# Altium project PROJEKT_PCB_299423.PrjPcb
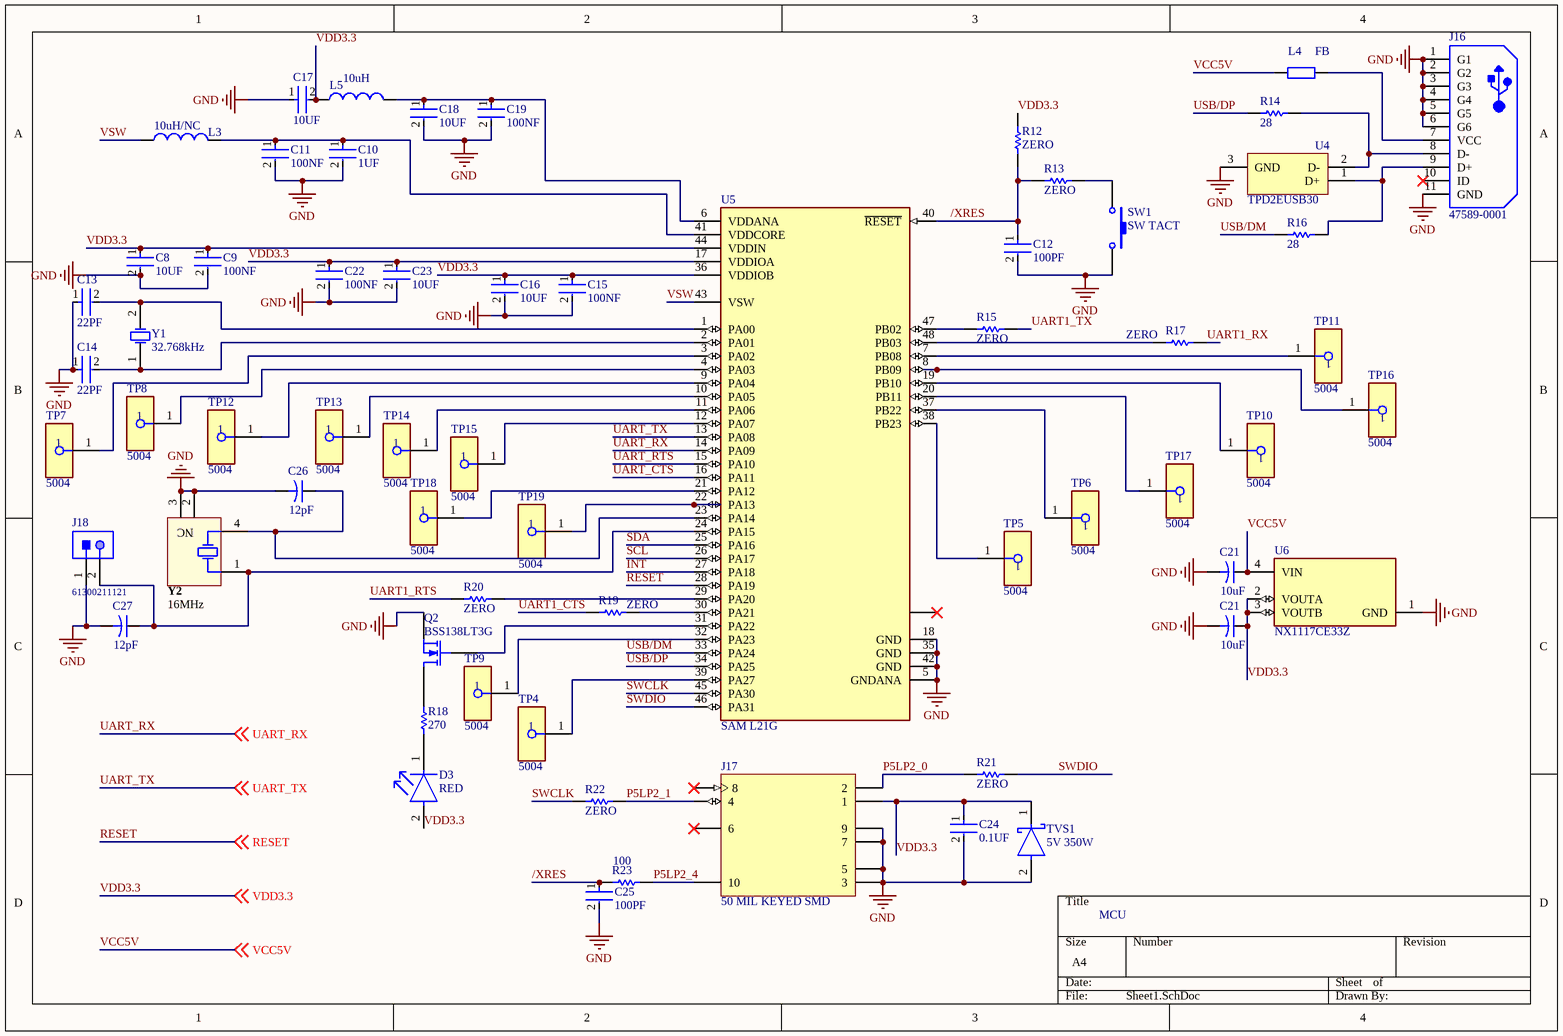
[diagram p0: Sheet1.SchDoc]
3 sheets, 112 parts. Net scope: global (net labels, ports and power ports of the same name join across sheets).
Board file: PCB2.PcbDoc
Sheets:
  Sheet1.SchDoc
  Sheet2.SchDoc
  Sheet3.SchDoc

## Sheet Sheet1.SchDoc
size A4; SheetNumber: 1; SheetTotal: 3

### Parts
(Parts that share a designator on the sheet are numbered #1, #2 ... from top to bottom, then left to right.)
10uH/NC  L3  [0402-A]
C8  10UF  [FP-C0805C-DN-MFG]
C9  100NF  [FP-C0805C-DN-MFG]
C10  1UF  [FP-C0805C-DN-MFG]
C11  100NF  [FP-C0805C-DN-MFG]
C12  100PF  [FP-C0805C-DN-MFG]
C13  22PF  [FP-C0805C-DN-MFG]
C14  22PF  [FP-C0805C-DN-MFG]
C15  100NF  [FP-C0805C-DN-MFG]
C16  10UF  [FP-C0805C-DN-MFG]
C17  10UF  [FP-C0805C-DN-MFG]
C18  10UF  [FP-C0805C-DN-MFG]
C19  100NF  [FP-C0805C-DN-MFG]
C21#1  value 10uF  [CAPR5-4X5]  (hidden comment: Cap2)
C21#2  value 10uF  [CAPR5-4X5]  (hidden comment: Cap2)
C22  100NF  [FP-C0805C-DN-MFG]
C23  10UF  [FP-C0805C-DN-MFG]
C24  0.1UF  [FP-C0805C-DN-MFG]
C25  100PF  [FP-C0805C-DN-MFG]
C26  value 12pF  [CAPR5-4X5]  (hidden comment: Cap2)
C27  value 12pF  [CAPR5-4X5]  (hidden comment: Cap2)
D3  RED  [FP-LTST-C190GKT-MFG]
FB  value L4  [AXIAL-0.4]  (hidden comment: Res2)
J16  47589-0001  [MOLX-47589-0001_V]
J17  50 MIL KEYED SMD  [VISH-VCNL4020-GS08_V]
J18  61300211121  [61300211121]
L5  value 10uH  [0402-A]  (hidden comment: Inductor)
Q2  BSS138LT3G  [E3]
R12  ZERO  [RESC1005X40X25NL05T10]
R13  ZERO  [RESC1005X40X25NL05T10]
R14  28  [RESC1005X40X25NL05T10]
R15  ZERO  [RESC1005X40X25NL05T10]
R16  28  [RESC1005X40X25NL05T10]
R17  ZERO  [RESC1005X40X25NL05T10]
R18  270  [RESC1005X40X25NL05T10]
R19  ZERO  [RESC1005X40X25NL05T10]
R20  ZERO  [RESC1005X40X25NL05T10]
R21  ZERO  [RESC1005X40X25NL05T10]
R22  ZERO  [RESC1005X40X25NL05T10]
R23  100  [RESC1005X40X25NL05T10]
SW1  SW TACT  [SPST-2]
TP4  5004  [FP-5004-MFG]
TP5  5004  [FP-5004-MFG]
TP6  5004  [FP-5004-MFG]
TP7  5004  [FP-5004-MFG]
TP8  5004  [FP-5004-MFG]
TP9  5004  [FP-5004-MFG]
TP10  5004  [FP-5004-MFG]
TP11  5004  [FP-5004-MFG]
TP12  5004  [FP-5004-MFG]
TP13  5004  [FP-5004-MFG]
TP14  5004  [FP-5004-MFG]
TP15  5004  [FP-5004-MFG]
TP16  5004  [FP-5004-MFG]
TP17  5004  [FP-5004-MFG]
TP18  5004  [FP-5004-MFG]
TP19  5004  [FP-5004-MFG]
TVS1  5V 350W  [FP-PowerDI123-MFG]
U4  TPD2EUSB30  [DRT0003A]
U5  SAM L21G  [FP-PE-MFG]
U6  NX1117CE33Z  [FP-DZD0004A-MFG]
Y1  32.768kHz  [R38]
Y2  16MHz  [ABRA-ABS25-4_V]

### Nets
GND: C8.2 C9.2 C10.2 C11.2 C12.2 C13.1 C14.1 C15.2 C16.2 C17.1 C18.2 C19.2 C21#1.2 C21#2.2 C22.2 C23.2 C24.2 C25.2 C26.2 C27.2 J16.1(G1) J16.2(G2) J16.3(G3) J16.4(G4) J16.5(G5) J16.6(G6) J16.11(GND) J17.6(9) J17.7 J17.8(5) J17.9(3) J18.1 Q2.3(S) SW1.2 TVS1.2(A) U4.3(GND) U5.5(GNDANA) U5.18(GND) U5.35(GND) U5.42(GND) U6.1(GND) Y2.2 Y2.3
/XRES: C12.1 C25.1 R12.1 R13.1 R23.1 U5.40(~{RESET})
INT: U5.27(PA18)
P5LP2_0: J17.1(2) R21.1
P5LP2_1: J17.2(4) R22.2
P5LP2_4: J17.5(10) R23.2
RESET: U5.28(PA19) ; off-sheet RESET
SCL: U5.26(PA17)
SDA: U5.25(PA16)
SWCLK: R22.1 U5.45(PA30)
SWDIO: R21.2 U5.46(PA31)
UART1_CTS: R19.1
UART1_RTS: R20.1
UART1_RX: R17.2
UART1_TX: R15.2
UART_CTS: U5.16(PA11)
UART_RTS: U5.15(PA10)
UART_RX: U5.14(PA09) ; off-sheet UART_RX
UART_TX: U5.13(PA08) ; off-sheet UART_TX
USB/DM: R16.1 U5.33(PA24)
USB/DP: R14.1 U5.34(PA25)
VCC5V: C21#1.1 FB.1 U6.4(VIN) ; off-sheet VCC5V
VDD3.3: C8.1 C9.1 C15.1 C16.1 C17.2 C21#2.1 C22.1 C23.1 C24.1 D3.2(A) J17.10(1) L5.1 R12.2 TVS1.1(C) U5.17(VDDIOA) U5.36(VDDIOB) U5.44(VDDIN) U6.2(VOUTA) U6.3(VOUTB) ; off-sheet VDD3.3
VSW: 10uH/NC.1 U5.43(VSW)
Net10uH/NC_2: 10uH/NC.2 C10.1 C11.1 U5.41(VDDCORE)
NetC13_2: C13.2 U5.1(PA00) Y1.2(OSC2)
NetC14_2: C14.2 U5.2(PA01) Y1.1(OSC1)
NetC18_1: C18.1 C19.1 L5.2 U5.6(VDDANA)
NetC26_1: C26.1 U5.23(PA14) Y2.4(X2)
NetC27_1: C27.1 J18.2 U5.24(PA15) Y2.1(X1)
NetD3_1: D3.1(C) R18.1
NetFB_2: FB.2 J16.7(VCC)
NetJ16_8: J16.8(D-) R14.2 U4.2(D-)
NetJ16_9: J16.9(D+) R16.2 U4.1(D+)
NetQ2_1: Q2.1(D) R18.2
NetQ2_2: Q2.2(G) U5.31(PA22)
NetR13_2: R13.2 SW1.1
NetR15_1: R15.1 U5.47(PB02)
NetR17_1: R17.1 U5.48(PB03)
NetR19_2: R19.2 U5.30(PA21)
NetR20_2: R20.2 U5.29(PA20)
NetTP4_1: TP4.1 U5.39(PA27)
NetTP5_1: TP5.1 U5.38(PB23)
NetTP6_1: TP6.1 U5.37(PB22)
NetTP7_1: TP7.1 U5.3(PA02)
NetTP8_1: TP8.1 U5.4(PA03)
NetTP9_1: TP9.1 U5.32(PA23)
NetTP10_1: TP10.1 U5.19(PB10)
NetTP11_1: TP11.1 U5.7(PB08)
NetTP12_1: TP12.1 U5.9(PA04)
NetTP13_1: TP13.1 U5.10(PA05)
NetTP14_1: TP14.1 U5.11(PA06)
NetTP15_1: TP15.1 U5.12(PA07)
NetTP16_1: TP16.1 U5.8(PB09)
NetTP17_1: TP17.1 U5.20(PB11)
NetTP18_1: TP18.1 U5.21(PA12)
NetTP19_1: TP19.1 U5.22(PA13)

Not connected (* = marked no-connect by the designer): J16 10(ID)*; J17 3(6)* 4(8)*; U5 49(EP)*

### Notes on the sheet
- MCU
- (in symbol CMP-2000-05037-1) NC

### Library data of the parts
10uH/NC = Inductor: Code_IEC: 1005; Value: 10uH; Published: 8-Jun-2000; LatestRevisionDate: 29-May-2009; LatestRevisionNote: IPC-7351 Footprint Added.; PackageReference: 0402-A; Publisher: Altium Limited; PackageDescription: Chip Inductor; Code_JEITA: 0402
C8-C19 C22-C25 = CMP-2007-00279-2: CAP CER 0.1UF 50V X7R 0805; Manufacturer Part Number: C0805C104K5RACTU; Manufacturer: KEMET; Value: 0.10 μF; Tolerance: 0.1; Temperature Coefficient: 30ppm/°C; Material: Ceramic; Device Class L2: Capacitors; Temperature Range Low: -55°C; Voltage Rating: 50 V; Digikey Description: CAP CER 0.1UF 50V X7R 0805; Category: Cap; ComponentLink2Description: Datasheet; Octopart: https://octopart.com/c0805c104k5ractu-kemet-143926; RoHS: TRUE; ComponentLink2URL: https://content.kemet.com/datasheets/KEM_C1003_C0G_SMD.pdf; Temperature Characteristic: X7R; Temperature: -55°C to +125°C; Height: 0.88mm; Temperature Range High: +125°C; Device Class L1: Passive Components; Automotive: No; Lead Free: Yes; Ipc Land Pattern Name: CAPC200125X78; Device Class L3: Ceramic Capacitors; Mouser Description: Cap Ceramic 0.1uF 50V X7R 10% SMD 2.0 x 1.2 mm 125 C Paper T/R; Capacitance: 0.10 μF; Package: C0805C-DN
C21#1 C21#2 C26 C27 = Cap2: Capacitor; Published: 23-Sep-2002; PackageReference: CAPR5-4X5; Publisher: Altium Limited; PackageDescription: Capacitor; 2 Leads
D3 = CMP-22017-000005-2: LED GREEN CLEAR CHIP SMD; Dominant Wavelength: 569nm; Reverse Voltage: 5V; Lens Color: Colorless; Viewing Angle: 130°; Voltage: 2V; Forward Current: 30mA; Power Dissipation: 100mW; Luminous Intensity: 6mcd; Number of LEDs: 1; Forward Voltage: 2.1V; Wavelength: 565nm; Test Current: 10mA; Min Operating Temperature: -55°C; Lens Style: Clear; Mount: Surface Mount; Width: 0.8mm; Packaging: Tape and Reel; Lens Transparency: Clear; Case Code (Metric): 1608; Depth: 0.8mm; Case Code (Imperial): 0603; Case/Package: 0603; Number of Pins: 2; Max Operating Temperature: 85°C; Lead Free: Lead Free; Number of Elements: 1; Length: 1.6mm; Height: 0.8mm; Package Quantity: 1; Power Rating: 100mW; Radiation Hardening: No; Illumination Color: Green; Color: Green
FB = Res2: Resistor; Published: 8-Jun-2000; LatestRevisionDate: 17-Jul-2002; LatestRevisionNote: Re-released for DXP Platform.; PackageReference: AXIAL-0.4; Publisher: Altium Limited; PackageDescription: Axial Device, Thru-Hole; 2 Leads; 0.4 in Pin Spacing
J16 = CMP-2000-05610-1: Right Angle Female Type AB Micro USB Connector, 30 V, 1.8 A, -30 to 85 degC, RoHS, Tape and Reel; Number of Ports: 1Port; Current Rating: 1.8A; Brand: Molex; Connector Type: MicroUSBTypeABreceptacle; Number of Contacts: 5Contact; Voltage Rating: 30VAC; Color: Black; Product: MicroUSBTypeABConnectors; Package URL: http://www.molex.com/pdm_docs/sd/475890001_sd.pdf; Contact Plating: Gold; Datasheet URL: http://www.molex.com/webdocs/datasheets/pdf/en-us/0475890001_IO_CONNECTORS.pdf; Operating Temperature Range: -20Cto+85C; Termination Style: SMD/SMT; Mounting Angle: Right; Package Reference: 47589-0001; Gender: Female; Package Description: Micro USB Connector, Pitch 0.65 mm, 5 Positions, Body 7.5 x 5.6 mm; Mounting Technology: SurfaceMount; Contact Material: CopperAlloy; Packaging: Reel; RoHS: True; Standard: USB; Manufacturer URL: http://www.molex.com/; Manufacturer: Molex; Datasheet Version: 12/2016; Product Category: USBConnectors; Series: 47589
J17 = CMP-2000-07387-1: Fully Integrated Proximity and Ambient Light Sensor with Infrared Emitter, I2C Interface, and Interrupt Function, 2.5 to 3.6 V, -25 to 85 degC, 10-Pin SMD, RoHS, Tape and Reel; Manufacturer: Vishay; Output Type: I²C; Other Names: VCNL4020-GS08DKR; Featured Product: VCNL4020OpticalSensor; Voltage - Supply: 2.5V~3.6V; Proximity Detection: Yes; Datasheet URL: http://www.vishay.com/docs/83476/vcnl4020.pdf; Supplier Device Package: SMD; Manufacturer URL: http://www.vishay.com/; Mounting Type: SurfaceMount; Type: Ambient; Package / Case: 10-VDFN; Series: -; Package Reference: VCNL4020-GS08; Wavelength: -; Standard Package: 1; Datasheet Version: Rev. 1.5, 08/2014; Packaging: Digi-Reel®; Package Description: 10-Pin Surface Mount Device, Body 4.9 x 2.4 mm; Family: OpticalSensors-AmbientLight,IR,UVSensors; Operating Temperature: -25°C~85°C; Category: Sensors,Transducers; Mounting Technology: SurfaceMount
J18 = CMP-1712-00002-4: THT Vertical Pin Header WR-PHD, Pitch 2.54 mm, Single Row, 2 pins; Manufacturer: Wurth Elektronik; Rated Current: 3A; Gender: Male; Withstanding Voltage: 500VAC; Working Voltage: 250VAC; Pitch: 2.54mm; Contact Resistance: 20mOhm; Pin Number: 2; Mounting Technology: THT; Orientation: Vertical; Operating Temperature: -40to105degC; Packaging: Bag; Publisher: WurthElektronik; Datasheet URL: https://katalog.we-online.de/em/datasheet/6130xx11121.pdf; Manufacturer URL: http://www.we-online.de; Row Number: Single; Package Reference: 61300211121; Part Number: 61300211121
L5 = Inductor: Code_IEC: 1005; Published: 8-Jun-2000; LatestRevisionDate: 29-May-2009; LatestRevisionNote: IPC-7351 Footprint Added.; PackageReference: 0402-A; Publisher: Altium Limited; PackageDescription: Chip Inductor; Code_JEITA: 0402
Q2 = MOSFET-N: N-Channel MOSFET; Published: 8-Jun-2000; LatestRevisionDate: 17-Jul-2002; LatestRevisionNote: Re-released for DXP Platform.; PackageVersion: 1995/1996; PackageReference: E3; Publisher: Altium Limited; PackageDescription: TO, Flat Index; 3 In-Line, Axial Leads; Body Dia. 4.6mm; Lead Dia. 0.5 mm (max)
R12-R23 = CMP-1011-00001-2: Manufacturer: Yageo / Phycomp; Part Number: RC0402JR-070RL
SW1 = SW-PB: Switch; Published: 24-Mar-1999; LatestRevisionDate: 17-Jul-2002; LatestRevisionNote: Re-released for DXP Platform.; PackageReference: SPST-2; Publisher: Altium Limited; PackageDescription: Switch; 2 Leads
TP4-TP19 = CMP-2000-05575-2: PC TEST POINT MINIATURE YELLOW; Manufacturer: Keystone; Number Of Contacts: 1; Is Female: yes; Device Class L1: Connectors; Manufacturer Part Number: 5004; Digikey Description: PC TEST POINT MINIATURE YELLOW; ComponentLink2URL: https://www.keyelco.com/product-pdf.cfm?p=1313; Lead Free: Yes; ComponentLink2Description: Datasheet; Category: Conn; Height: 4.72mm; Octopart: https://octopart.com/5004-keystone-28591; Mouser Description: TEST POINT PC MINI .040"D YELLOW; Device Class L3: unset; Contact Material: Silver; Package: 5004; Automotive: No; Device Class L2: unset; RoHS: TRUE
TVS1 = CMP-2000-07540-2: DIODE SCHOTTKY 200V POWERDI123; Manufacturer: Diodes Inc.; Manufacturer Part Number: DFLS1200-7; Automotive Grade: Grade 0; Peak Reverse Current: 2uA; Capacitance: 23pF; Forward Current: 1A; Value: 23pF; Max Surge Forward Current: 40A; Max Junction Temp: +175°C; Temperature Range Low: -65°C; Mouser Description: Schottky Diodes & Rectifiers SCHOTTKY RECTIFIER; Package: PowerDI123; Footprint Url: https://www.diodes.com/assets/Package-Files/PowerDI123.pdf; Max Repetitive Reverse Voltage: 200V; Device Class L2: Diodes; Temperature Range High: +175°C; Device Class L1: Discrete Semiconductors; ComponentLink2URL: https://www.diodes.com/assets/Datasheets/ds30628.pdf; Category: Diode; Lead Free: Yes; Temperature: -65°C to +175°C; Reverse Voltage: 200V; Height: 1mm; Digikey Description: DIODE SCHOTTKY 200V POWERDI123; RoHS: TRUE; ComponentLink2Description: Datasheet; Device Class L3: Schottky Diodes; Automotive: Yes; Octopart: https://octopart.com/dfls1200-7-diodes+inc.-13134059
U4 = CMP-0326-00046-3: ESD Solution for Super-Speed (6 Gbps) USB 3.0 Interface, 2 Channels, -40 to +85 degC, 3-pin SOT (DRT), Green (Rohs & No Sb/Br); Manufacturer: Texas Instruments; PartNumber: TPD2EUSB30DRTR; Differential Capacitance(pF): 0.01; Breakdown Voltage(Min)(V): 9; HDMI: TRUE; IEC 61000-4-2 Air-Gap(+/- kV): 8; IO Leakage Current(nA): 10; IO Capacitance(Typ)(pF): 0.7; Mounting Technology: Surface Mount; PackageDescription: 3-Flat Lead Plastic Small Outline, 1 x 1 mm (inc leads), 0.35 mm Pitch; IEC 61000-4-2 Contact(+/- kV): 8; USB Super Speed: TRUE; Eco-Plan: Green (RoHS & no Sb/Br); USB High Speed: TRUE; PackageReference: DRT0003A; SubFamily: ESD Solution; USB Full Speed: TRUE; ComponentLink1Description: Datasheet; ComponentLink2URL: SamplesURL:http://www.ti.com/product/tpd2eusb30#samples; PackageVersion: revD, Jun-2008; ComponentLink2Description: URL Link1; 1394 / Firewire: TRUE; ComponentLink1URL: http://www.ti.com/general/docs/lit/getliterature.tsp?genericPartNumber=TPD2EUSB30&fileType=pdf; DatasheetVersion: SLVSAC2C; Serial ATA / eSATA: TRUE
U5 = CMP-06276-000162-1: IC MCU 32BIT 256KB FLASH 48QFN; Core Architecture: ARM; Peripherals: POR; Oscillator Type: Internal; Frequency: 48MHz; Interface: I2C; Number of I/Os: 37; Case/Package: QFN; Memory Type: FLASH; RoHS Compliant: Yes; Packaging: Tape and Reel; Min Operating Temperature: -40°C; Max Operating Temperature: 85°C; Memory Size: 256KB
U6 = CMP-2000-04961-2: TVS DIODE 5.5V 4SOP; Test Current: 10mA; Clamping Voltage: 105.5V; Direction: Unidirectional; Number of Bidirectional Channels: 2; Min Breakdown Voltage: 11V; Interface: LVDS; Leakage Current: 1nA; Min Supply Voltage: 900mV; ESD Protection: Yes; Capacitance: 1.5pF; Element Configuration: Dual; Mount: Surface Mount; Max Supply Voltage: 5.5V; Number of Channels: 2; Package Quantity: 1; Radiation Hardening: No; Width: 1.4mm; Max Operating Temperature: 85°C; RoHS Compliant: Yes; Power Line Protection: Yes; Depth: 1.4mm; Length: 3.04mm; Height: 1.07mm; Min Operating Temperature: -40°C; Breakdown Voltage: 11V; Lead Free: Lead Free; Number of Pins: 4; Case/Package: SOP; Termination: Solder; Packaging: Tape and Reel; Reverse Standoff Voltage: 5.5V; Max Reverse Leakage Current: 1nA; REACH SVHC: No SVHC
Y1 = XTAL: Crystal Oscillator; Published: 8-Jun-2000; LatestRevisionDate: 17-Jul-2002; LatestRevisionNote: Re-released for DXP Platform.; PackageReference: R38; Publisher: Altium Limited; PackageDescription: Crystal, Thru-Hole; 2 Leads; Body 3.1 x 8.2 mm (Dia.xH)
Y2 = CMP-2000-05037-1: Low Frequency Crystal, 32.768 KHz, -40 to 85 degC, 4-Pin SMD, RoHS, Tape and Reel; Load Capacitance: 12.5pF; Tolerance: 20PPM; Brand: ABRACON; ESR: 50kOhms; Case Length: 8mm; Case Width: 3.8mm; Case Height: 2.5mm; RoHS: Details; Product Category: Crystals; Frequency: 32.768kHz; Datasheet Version: May-11; Series: ABS25; Datasheet URL: https://datasheet.ciiva.com/7998/1700987-7998663.pdf; Termination Style: SMD/SMT; Package Reference: ABS25; Dimensions: 3.8mmWx8mmLx2.5mmH; Package / Case: 8mmx3.8mm; Manufacturer: Abracon; Manufacturer URL: http://www.abracon.com/; Mounting Style: SMD/SMT; Package Description: 4-Pin Surface Mount Device, Body 8 x 3.8 mm, Pitch 5.5 mm; Operating Temperature Range: -40Cto+85C; Factory Pack Quantity: 1000; Type: LowFrequencyCrystal; Packaging: Reel

## Sheet Sheet2.SchDoc
size A4; SheetNumber: 2; SheetTotal: 3
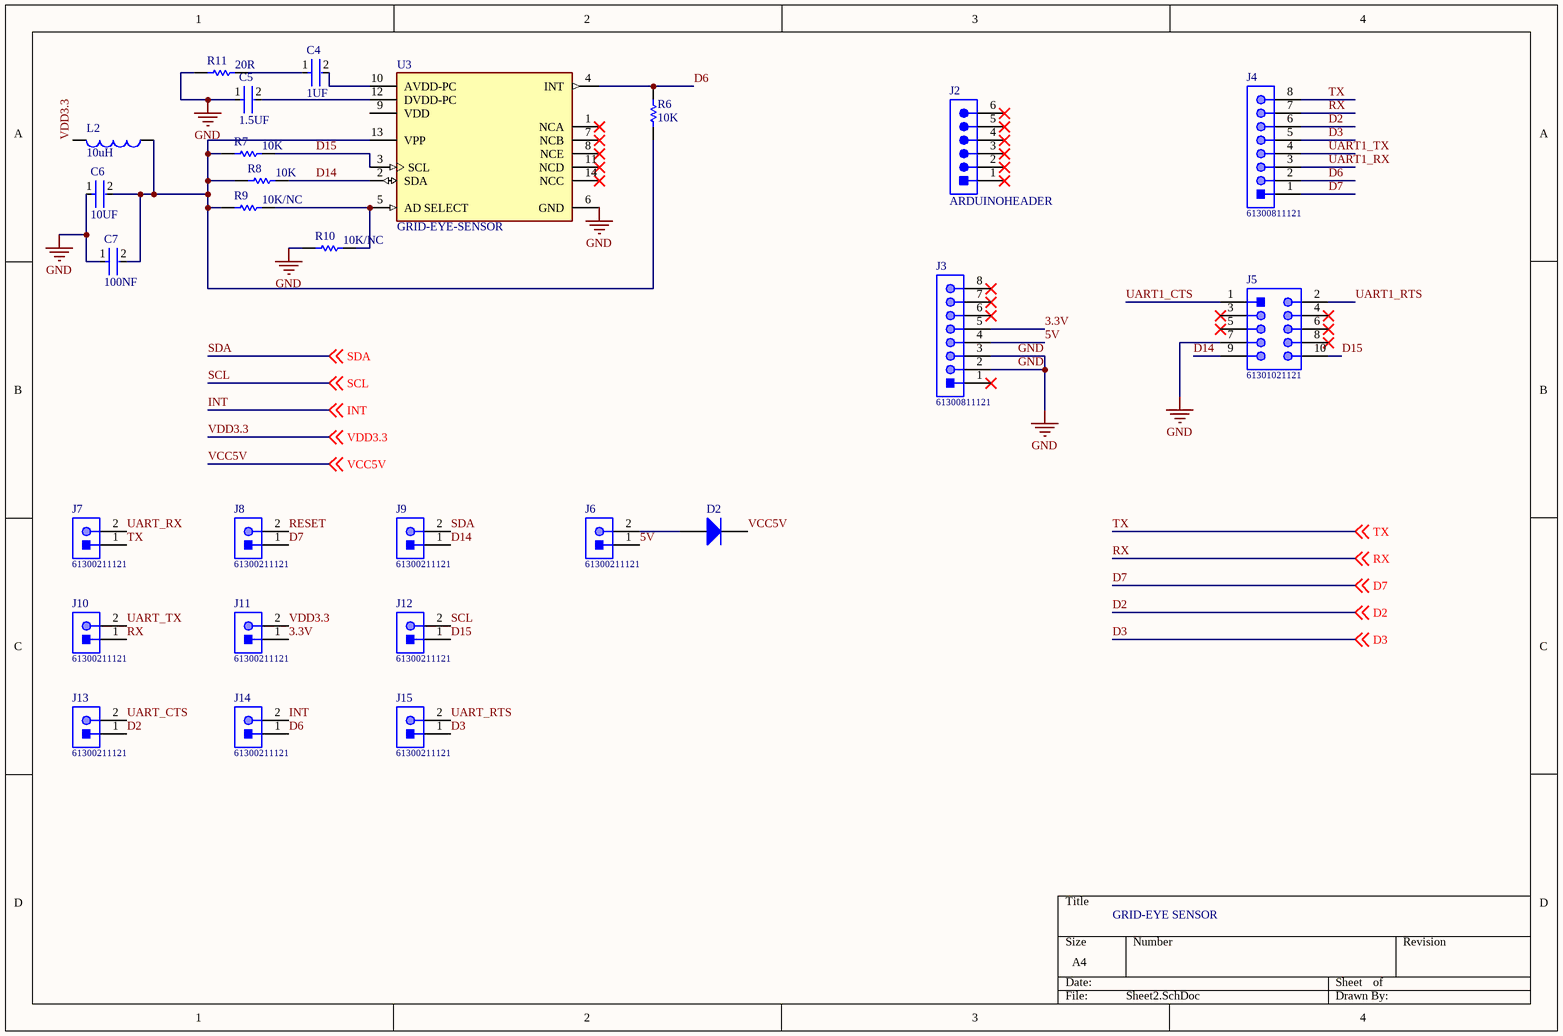
[diagram p1: Sheet2.SchDoc]

### Parts
C4  1UF  [FP-C0805C-DN-MFG]
C5  1.5UF  [FP-C0805C-DN-MFG]
C6  10UF  [FP-C0805C-DN-MFG]
C7  100NF  [FP-C0805C-DN-MFG]
D2  1N4148W-7-F  [DIOD-SOD123-2_V]  (value not drawn)
J2  ARDUINOHEADER  [TECO-640456-6_V]
J3  61300811121  [61300811121]
J4  61300811121  [61300811121]
J5  61301021121  [61301021121]
J6  61300211121  [61300211121]
J7  61300211121  [61300211121]
J8  61300211121  [61300211121]
J9  61300211121  [61300211121]
J10  61300211121  [61300211121]
J11  61300211121  [61300211121]
J12  61300211121  [61300211121]
J13  61300211121  [61300211121]
J14  61300211121  [61300211121]
J15  61300211121  [61300211121]
L2  value 10uH  [0402-A]  (hidden comment: Inductor)
R6  10K  [RESC1005X40X25NL05T10]
R7  10K  [RESC1005X40X25NL05T10]
R8  10K  [RESC1005X40X25NL05T10]
R9  10K/NC  [RESC1005X40X25NL05T10]
R10  10K/NC  [RESC1005X40X25NL05T10]
R11  20R  [RESC1005X40X25NL05T10]
U3  GRID-EYE-SENSOR  [FP-AMG8834-MFG]

### Nets
GND: C5.1 C6.1 C7.1 J3.2 J3.3 J5.7 R10.1 R11.1 U3.6(GND)
3.3V: J3.5 J11.1
5V: J3.4 J6.1
D2: J4.6 J13.1 ; off-sheet D2
D3: J4.5 J15.1 ; off-sheet D3
D6: J4.2 J14.1 R6.2 U3.4(INT)
D7: J4.1 J8.1 ; off-sheet D7
D14: J5.9 J9.1 R8.2 U3.2(SDA)
D15: J5.10 J12.1 R7.2 U3.3(SCL)
INT: J14.2 ; off-sheet INT
RESET: J8.2
RX: J4.7 J10.1 ; off-sheet RX
SCL: J12.2 ; off-sheet SCL
SDA: J9.2 ; off-sheet SDA
TX: J4.8 J7.1 ; off-sheet TX
UART1_CTS: J5.1
UART1_RTS: J5.2
UART1_RX: J4.3
UART1_TX: J4.4
UART_CTS: J13.2
UART_RTS: J15.2
UART_RX: J7.2
UART_TX: J10.2
VCC5V: D2.2(K) ; off-sheet VCC5V
VDD3.3: J11.2 L2.2 ; off-sheet VDD3.3
NetC4_1: C4.1 R11.2
NetC4_2: C4.2 U3.10(AVDD-PC)
NetC5_2: C5.2 U3.12(DVDD-PC)
NetC6_2: C6.2 C7.2 L2.1 R6.1 R7.1 R8.1 R9.1 U3.13(VPP)
NetD2_1: D2.1(A) J6.2
NetR9_2: R9.2 R10.2 U3.5(AD_SELECT)

Not connected (* = marked no-connect by the designer): J2 1* 2* 3* 4* 5* 6*; J3 1* 6* 7* 8*; J5 3* 4* 5* 6* 8*; U3 1(NCA)* 7(NCB)* 8(NCE)* 9(VDD) 11(NCD)* 14(NCC)*

### Notes on the sheet
- GRID-EYE SENSOR

### Library data of the parts
C4-C7 = CMP-2007-00279-2: CAP CER 0.1UF 50V X7R 0805; Manufacturer Part Number: C0805C104K5RACTU; Manufacturer: KEMET; Value: 0.10 μF; Description: C0805 0.10 μF X7R 30ppm/°C 10.00% 50 V; Tolerance: 0.1; Temperature Coefficient: 30ppm/°C; Material: Ceramic; Device Class L2: Capacitors; Temperature Range Low: -55°C; Voltage Rating: 50 V; Digikey Description: CAP CER 0.1UF 50V X7R 0805; Category: Cap; ComponentLink2Description: Datasheet; Octopart: https://octopart.com/c0805c104k5ractu-kemet-143926; RoHS: TRUE; ComponentLink2URL: https://content.kemet.com/datasheets/KEM_C1003_C0G_SMD.pdf; Temperature Characteristic: X7R; Temperature: -55°C to +125°C; Height: 0.88mm; Temperature Range High: +125°C; Device Class L1: Passive Components; Automotive: No; Lead Free: Yes; Ipc Land Pattern Name: CAPC200125X78; Device Class L3: Ceramic Capacitors; Mouser Description: Cap Ceramic 0.1uF 50V X7R 10% SMD 2.0 x 1.2 mm 125 C Paper T/R; Capacitance: 0.10 μF; Package: C0805C-DN
D2 = CMP-2000-04932-2: Fast Switching Diode, 100 V, 0.15 A, -65 to 150 degC, 2-Pin?SOD123, RoHS, Tape and Reel; Recovery Time: 4ns; Brand: DiodesIncorporated; Unit Weight: 0.000353oz; Max Surge Current: 2A; Peak Reverse Voltage: 100V; Ir - Reverse Current: 1uA; Vf - Forward Voltage: 1.25V; Configuration: Single; If - Forward Current: 0.15A; Product Category: Diodes-GeneralPurpose,Power,Switching; Operating Temperature Range: -65Cto+150C; Packaging: Reel; Manufacturer URL: http://www.diodes.com/; Maximum Operating Temperature: +150C; Height: 1.25mm; Minimum Operating Temperature: -65C; Product: SwitchingDiodes; Package URL: http://www.diodes.com/datasheets/ds18004.pdf; Type: SwitchingDiode; Package Reference: SOD123-2; Width: 1.7mm; Datasheet URL: http://www.farnell.com/datasheets/1915529.pdf; Datasheet Version: Rev. 24-2, 10/2013; Series: 1N4148; Factory Pack Quantity: 3000; Length: 2.85mm; RoHS: True; Manufacturer: DiodesIncorporated; Mounting Style: SMD/SMT; Package / Case: SOD-123
J2 = CMP-2000-05661-1: Male Header, Pitch 2.54 mm, 1 x 6 Position, Height 10.03 mm, Tail Length 3.56 mm, -55 to 105 degC, Bulk; Manufacturer: TE Connectivity; Contact Centerline Spacing: 0.100 / in.; Number of Contacts: 6; Current, Rating: 5 / A; Agency Approvals: CSA,UL; Material, Contact: CopperAlloy; Mounting Hole Size: 0.04 / "; Brand/Series: MTA-100Series; Pin Spacing: 0.1 / "; Mount Angle: Vertical; Contact Termination Area Plating: Tin; Angle: Straight; Primary Type: InterconnectSystem; Standards: RoHSCompliant,ELVCompliant,UL94V-0; Temperature, Operating: -55to+105 / °C; Material, Housing: Polyester; Special Features: Pinstrip; Color, Housing: White; Connector Type: MTA-100; Voltage, Rating: 250 / V; Termination: Solder; Package Reference: 640456-6; Size, Post: 0.025 / in.; Color: White; Datasheet URL: https://datasheet.ciiva.com/25618/0900766b80eb7fdd-25618163.pdf; Manufacturer URL: http://www.te.com/; Mounting Type: PCMount; Length, Pin: 0.14 / "; Type: PCBPlug; Length, Overall: 0.6 / "; Mounting Technology: ThroughHole; Number of Rows: 1; Contact Shape: Square; Contact Mating Area Plating: Tin; Datasheet Version: Rev. W, 05/2005; Number of Positions: 6; Package Description: Male Header, Pitch 2.54 mm, 1 x 6 Position, Height 10.03 mm, Tail Length 3.56 mm; Contact Plating: Tin; Length, Terminal Post: 0.14 / in.; Flammability Rating: UL94V-0
J3 J4 = CMP-1502-01076-1: THT Vertical Pin Header WR-PHD, Pitch 2.54 mm, Single Row, 8 pins; Manufacturer: Wurth Elektronik; Rated Current: 3A; Pin Number: 8; Working Voltage: 250VAC; Gender: Male; Contact Resistance: 20mOhm; Pitch: 2.54mm; Withstanding Voltage: 500VAC; Publisher: WurthElektronik; Operating Temperature: -40to105degC; Orientation: Vertical; Row Number: Single; Part Number: 61300811121; Package Reference: 61300811121; Mounting Technology: THT; Packaging: Bag; Manufacturer URL: http://www.we-online.de; Datasheet URL: https://katalog.we-online.de/em/datasheet/6130xx11121.pdf
J5 = CMP-1502-01084-1: THT Vertical Pin Header WR-PHD, Pitch 2.54 mm, Dual Row, 10 pins; Manufacturer: Wurth Elektronik; Working Voltage: 250VAC; Pitch: 2.54mm; Contact Resistance: 20mOhm; Gender: Male; Rated Current: 3A; Withstanding Voltage: 500VAC; Pin Number: 10; Operating Temperature: -40to105degC; Mounting Technology: THT; Publisher: WurthElektronik; Manufacturer URL: http://www.we-online.de; Part Number: 61301021121; Row Number: Dual; Packaging: Bag; Orientation: Vertical; Package Reference: 61301021121; Datasheet URL: https://katalog.we-online.de/em/datasheet/6130xx21121.pdf
J6-J15 = CMP-1712-00002-4: as J18 on sheet Sheet1; Mounting Technology: THT; Orientation: Vertical; Operating Temperature: -40to105degC; Packaging: Bag; Publisher: WurthElektronik; Datasheet URL: https://katalog.we-online.de/em/datasheet/6130xx11121.pdf; Manufacturer URL: http://www.we-online.de; Row Number: Single; Package Reference: 61300211121; Part Number: 61300211121
L2 = Inductor: Code_IEC: 1005; Published: 8-Jun-2000; LatestRevisionDate: 29-May-2009; LatestRevisionNote: IPC-7351 Footprint Added.; PackageReference: 0402-A; Publisher: Altium Limited; PackageDescription: Chip Inductor; Code_JEITA: 0402
R6-R11 = CMP-1011-00001-2: as R12 on sheet Sheet1
U3 = CMP-05551-000001-1: SENSOR DGTL 14SMD MODULE; Sensing Method: Infrared (IR); Output Type: I2C; Case/Package: SMD/SMT; Max Operating Temperature: 80°C; Min Operating Temperature: -20°C; Packaging: Tape and Reel

## Sheet Sheet3.SchDoc
size A4; SheetNumber: 3; SheetTotal: 3
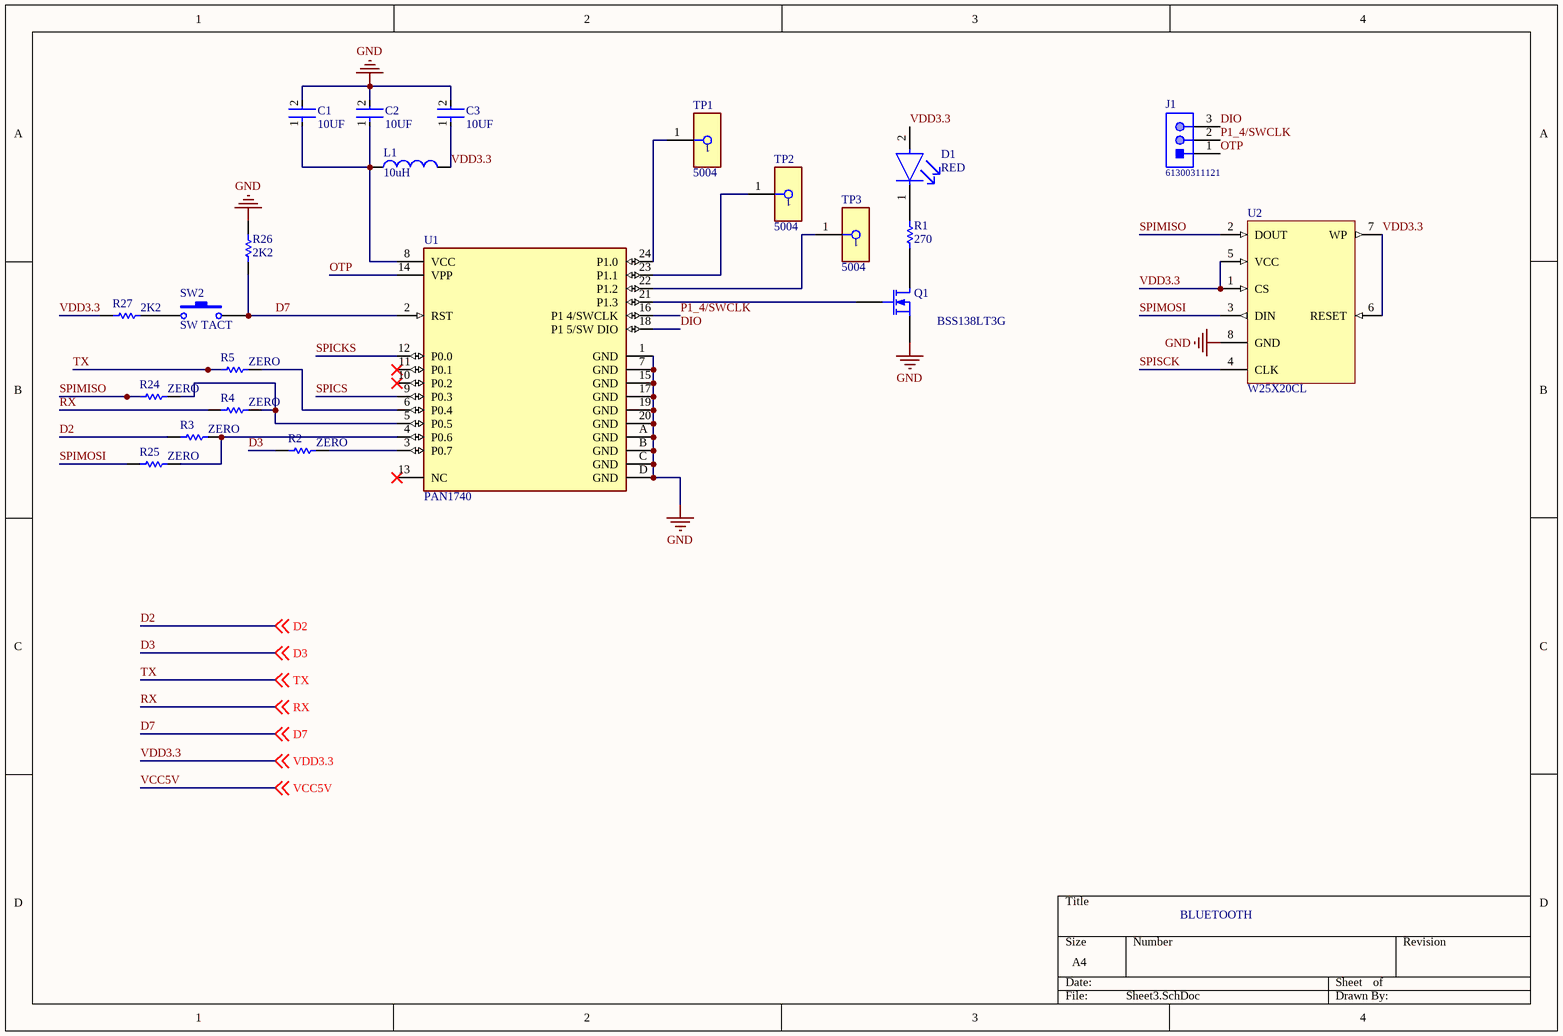
[diagram p2: Sheet3.SchDoc]

### Parts
C1  10UF  [FP-C0805C-DN-MFG]
C2  10UF  [FP-C0805C-DN-MFG]
C3  10UF  [FP-C0805C-DN-MFG]
D1  RED  [FP-LTST-C190GKT-MFG]
J1  61300311121  [61300311121]
L1  value 10uH  [0402-A]  (hidden comment: Inductor)
Q1  BSS138LT3G  [E3]
R1  270  [RESC1005X40X25NL05T10]
R2  ZERO  [RESC1005X40X25NL05T10]
R3  ZERO  [RESC1005X40X25NL05T10]
R4  ZERO  [RESC1005X40X25NL05T10]
R5  ZERO  [RESC1005X40X25NL05T10]
R24  ZERO  [RESC1005X40X25NL05T10]
R25  ZERO  [RESC1005X40X25NL05T10]
R26  2K2  [RESC1005X40X25NL05T10]
R27  2K2  [RESC1005X40X25NL05T10]
SW2  SW TACT  [SPST-2]
TP1  5004  [FP-5004-MFG]
TP2  5004  [FP-5004-MFG]
TP3  5004  [FP-5004-MFG]
U1  PAN1740  [FP-ENW-89846A1KF-MFG]
U2  W25X20CL  [PDIP300-P8]

### Nets
GND: C1.2 C2.2 C3.2 Q1.3(S) R26.2 U1.1(GND) U1.7(GND) U1.15(GND) U1.17(GND) U1.19(GND) U1.20(GND) U1.A(GND) U1.B(GND) U1.C(GND) U1.D(GND) U2.8(GND)
D2: R3.1 ; off-sheet D2
D3: R2.1 ; off-sheet D3
D7: R26.1 SW2.2 U1.2(RST) ; off-sheet D7
DIO: J1.3 U1.18(P1_5/SW_DIO)
OTP: J1.1 U1.14(VPP)
P1_4/SWCLK: J1.2 U1.16(P1_4/SWCLK)
RX: R4.1 ; off-sheet RX
SPICKS: U1.12(P0.0)
SPICS: U1.9(P0.3)
SPIMISO: R24.1 U2.2(DOUT)
SPIMOSI: R25.1 U2.3(DIN)
SPISCK: U2.4(CLK)
TX: R5.1 ; off-sheet TX
VDD3.3: C3.1 D1.2(A) L1.2 R27.1 U2.1(CS) U2.5(VCC) U2.6(RESET) U2.7(WP) ; off-sheet VDD3.3
NetC1_1: C1.1 C2.1 L1.1 U1.8(VCC)
NetD1_1: D1.1(C) R1.2
NetQ1_1: Q1.1(D) R1.1
NetQ1_2: Q1.2(G) U1.21(P1.3)
NetR2_2: R2.2 U1.3(P0.7)
NetR3_2: R3.2 R25.2 U1.4(P0.6)
NetR4_2: R4.2 R24.2 U1.5(P0.5)
NetR5_2: R5.2 U1.6(P0.4)
NetR27_2: R27.2 SW2.1
NetTP1_1: TP1.1 U1.24(P1.0)
NetTP2_1: TP2.1 U1.23(P1.1)
NetTP3_1: TP3.1 U1.22(P1.2)

Not connected (* = marked no-connect by the designer): U1 10(P0.2)* 11(P0.1)* 13(NC)*

### Notes on the sheet
- BLUETOOTH

### Library data of the parts
C1-C3 = CMP-2007-00279-2: as C8 on sheet Sheet1; Device Class L2: Capacitors; Temperature Range Low: -55°C; Voltage Rating: 50 V; Digikey Description: CAP CER 0.1UF 50V X7R 0805; Category: Cap; ComponentLink2Description: Datasheet; Octopart: https://octopart.com/c0805c104k5ractu-kemet-143926; RoHS: TRUE; ComponentLink2URL: https://content.kemet.com/datasheets/KEM_C1003_C0G_SMD.pdf; Temperature Characteristic: X7R; Temperature: -55°C to +125°C; Height: 0.88mm; Temperature Range High: +125°C; Device Class L1: Passive Components; Automotive: No; Lead Free: Yes; Ipc Land Pattern Name: CAPC200125X78; Device Class L3: Ceramic Capacitors; Mouser Description: Cap Ceramic 0.1uF 50V X7R 10% SMD 2.0 x 1.2 mm 125 C Paper T/R; Capacitance: 0.10 μF; Package: C0805C-DN
D1 = CMP-22017-000005-2: as D3 on sheet Sheet1; Min Operating Temperature: -55°C; Lens Style: Clear; Mount: Surface Mount; Width: 0.8mm; Packaging: Tape and Reel; Lens Transparency: Clear; Case Code (Metric): 1608; Depth: 0.8mm; Case Code (Imperial): 0603; Case/Package: 0603; Number of Pins: 2; Max Operating Temperature: 85°C; Lead Free: Lead Free; Number of Elements: 1; Length: 1.6mm; Height: 0.8mm; Package Quantity: 1; Power Rating: 100mW; Radiation Hardening: No; Illumination Color: Green; Color: Green
J1 = CMP-1502-01062-1: THT Vertical Pin Header WR-PHD, Pitch 2.54 mm, Single Row, 3 pins; Manufacturer: Wurth Elektronik; Withstanding Voltage: 500VAC; Working Voltage: 250VAC; Rated Current: 3A; Pitch: 2.54mm; Pin Number: 3; Gender: Male; Contact Resistance: 20mOhm; Package Reference: 61300311121; Manufacturer URL: http://www.we-online.de; Datasheet URL: https://katalog.we-online.de/em/datasheet/6130xx11121.pdf; Operating Temperature: -40to105degC; Part Number: 61300311121; Orientation: Vertical; Packaging: Bag; Row Number: Single; Mounting Technology: THT; Publisher: WurthElektronik
L1 = Inductor: Code_IEC: 1005; Published: 8-Jun-2000; LatestRevisionDate: 29-May-2009; LatestRevisionNote: IPC-7351 Footprint Added.; PackageReference: 0402-A; Publisher: Altium Limited; PackageDescription: Chip Inductor; Code_JEITA: 0402
Q1 = MOSFET-N: N-Channel MOSFET; Published: 8-Jun-2000; LatestRevisionDate: 17-Jul-2002; LatestRevisionNote: Re-released for DXP Platform.; PackageVersion: 1995/1996; PackageReference: E3; Publisher: Altium Limited; PackageDescription: TO, Flat Index; 3 In-Line, Axial Leads; Body Dia. 4.6mm; Lead Dia. 0.5 mm (max)
R1-R5 R24-R27 = CMP-1011-00001-2: as R12 on sheet Sheet1
SW2 = SW-PB: Switch; Published: 24-Mar-1999; LatestRevisionDate: 17-Jul-2002; LatestRevisionNote: Re-released for DXP Platform.; PackageReference: SPST-2; Publisher: Altium Limited; PackageDescription: Switch; 2 Leads
TP1-TP3 = CMP-2000-05575-2: as TP4 on sheet Sheet1; Device Class L1: Connectors; Manufacturer Part Number: 5004; Digikey Description: PC TEST POINT MINIATURE YELLOW; ComponentLink2URL: https://www.keyelco.com/product-pdf.cfm?p=1313; Lead Free: Yes; ComponentLink2Description: Datasheet; Category: Conn; Height: 4.72mm; Octopart: https://octopart.com/5004-keystone-28591; Mouser Description: TEST POINT PC MINI .040"D YELLOW; Device Class L3: unset; Contact Material: Silver; Package: 5004; Automotive: No; Device Class L2: unset; RoHS: TRUE
U1 = CMP-05527-000002-1: RF TXRX MOD BLUETOOTH CHIP ANT; Manufacturer: Panasonic; Manufacturer Part Number: ENW-89846A1KF; Number Of Gpio: 14; Number Of Adc Channels: 4; Max Frequency: 2.4GHz; Interface: I2C,SPI,UART; Sensitivity: -93dBm; Receiving Current: 4.9mA; Max Supply Voltage: 3.3V; Data Rate: 1Mbits/s; Min Supply Voltage: 2.35V; Temperature Range High: +85°C; Category: UNK; ComponentLink2Description: Datasheet; Temperature Range Low: -40°C; Lead Free: Yes; ComponentLink2URL: https://b2b-api.panasonic.eu/file_stream/pids/fileversion/4534; Digikey Description: RF TXRX MOD BLUETOOTH CHIP ANT; Ambient Temperature Range Low: -40°C; Device Class L2: RF Semiconductors and Devices; Ambient Temperature Range High: +85°C; Device Class L3: Transceivers; Height: 2mm; Package: 0; Automotive: No; Transmitting Current: 4.9mA; Temperature: -40°C to +85°C; Device Class L1: Integrated Circuits (ICs); Octopart: https://octopart.com/enw-89846a1kf-panasonic-38566823; RoHS: TRUE
U2 = CMP-0186-00092-2: Infrared Encoder/Decoder, PDIP, Extended Temperature; DatasheetVersion: revC, Feb-2007; ComponentLink2Description: Datasheet; ComponentLink2URL: http://ww1.microchip.com/downloads/en/DeviceDoc/21894c.pdf; ComponentLink1Description: Manufacturer URL; PackageVersion: revBB, Aug-2009; Code_JEDEC: MS-001; ComponentLink3Description: Package Specification; PackageReference: PDIP300-P8; RevisionNote: URLs added.; PackageDescription: 8-Lead Plastic Dual In-Line (P) - 300 mil Body [PDIP]; ComponentLink1URL: http://www.microchip.com/; ComponentLink3URL: http://www.microchip.com/stellent/groups/techpub_sg/documents/packagingspec/en012702.pdf

## Nets that join several sheets
GND: Sheet1 (43 pins), Sheet2 (9 pins), Sheet3 (16 pins)
D2: Sheet2 (J4.6 J13.1), Sheet3 (R3.1)
D3: Sheet2 (J4.5 J15.1), Sheet3 (R2.1)
D7: Sheet2 (J4.1 J8.1), Sheet3 (R26.1 SW2.2 U1.2)
INT: Sheet1 (U5.27), Sheet2 (J14.2)
RESET: Sheet1 (U5.28), Sheet2 (J8.2)
RX: Sheet2 (J4.7 J10.1), Sheet3 (R4.1)
SCL: Sheet1 (U5.26), Sheet2 (J12.2)
SDA: Sheet1 (U5.25), Sheet2 (J9.2)
TX: Sheet2 (J4.8 J7.1), Sheet3 (R5.1)
UART1_CTS: Sheet1 (R19.1), Sheet2 (J5.1)
UART1_RTS: Sheet1 (R20.1), Sheet2 (J5.2)
UART1_RX: Sheet1 (R17.2), Sheet2 (J4.3)
UART1_TX: Sheet1 (R15.2), Sheet2 (J4.4)
UART_CTS: Sheet1 (U5.16), Sheet2 (J13.2)
UART_RTS: Sheet1 (U5.15), Sheet2 (J15.2)
UART_RX: Sheet1 (U5.14), Sheet2 (J7.2)
UART_TX: Sheet1 (U5.13), Sheet2 (J10.2)
VCC5V: Sheet1 (C21#1.1 FB.1 U6.4), Sheet2 (D2.2)
VDD3.3: Sheet1 (19 pins), Sheet2 (J11.2 L2.2), Sheet3 (8 pins)